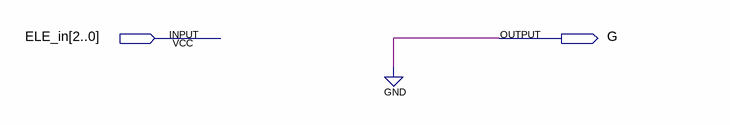
[diagram p0: schematic sheet]
// Quartus schematic DECOD_ELE_G.bdf as structural Verilog: 0 symbols, 2 pins
module DECOD_ELE_G (
  input  [2:0] ELE_in,
  output G
);


  assign G = 1'b0;
endmodule
